# EAGLE design SparkFun_MicroMod_Function_Board_Blues_Notecarrier (EAGLE 9.6.2)
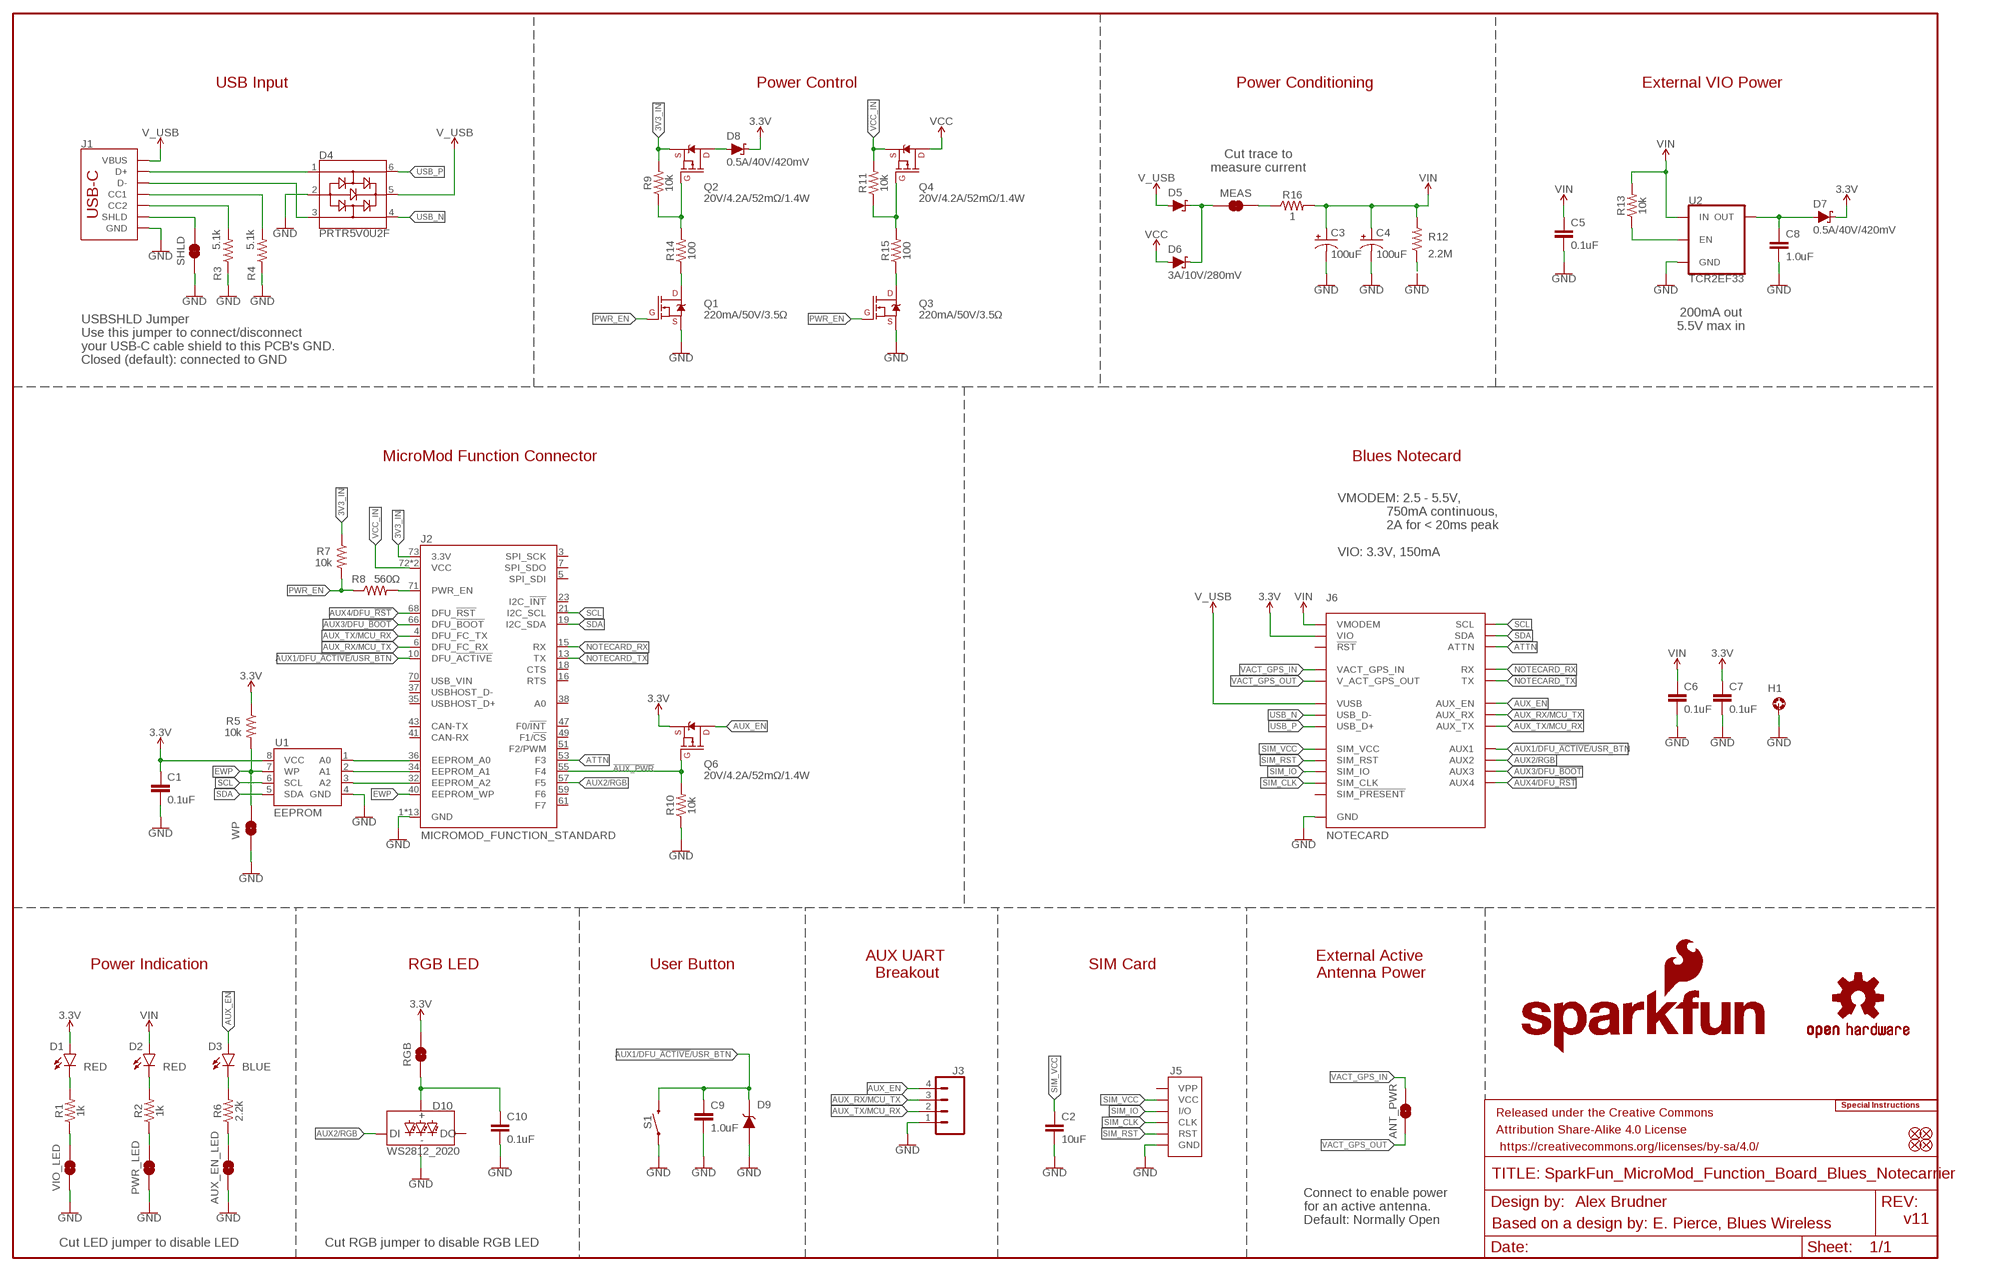
[diagram p0: schematic, sheet 1]

## Parts
ANT_PWR  JUMPER-SMT_2_NO_SILK  [SMT-JUMPER_2_NO_SILK]
AUX_EN_LED  JUMPER-SMT_2_NC_TRACE_SILK  [SMT-JUMPER_2_NC_TRACE_SILK]
C1  0.1uF  0.1UF-0402T-16V-10%  [0402-TIGHT]
C2  10uF  10UF-0805-10V-10%  [0805]
C3  100uF  100UF-POLAR-25V-20%-SMD(ELEC)  [PANASONIC_D]
C4  100uF  100UF-POLAR-25V-20%-SMD(ELEC)  [PANASONIC_D]
C5  0.1uF  0.1UF-0402T-16V-10%  [0402-TIGHT]
C6  0.1uF  0.1UF-0402T-16V-10%  [0402-TIGHT]
C7  0.1uF  0.1UF-0402T-16V-10%  [0402-TIGHT]
C8  1.0uF  1.0UF-0402T-16V-10%  [0402-TIGHT]
C9  1.0uF  1.0UF-0402T-16V-10%  [0402-TIGHT]
C10  0.1uF  0.1UF-0402T-16V-10%  [0402-TIGHT]
D1  RED  LED-RED0603  [LED-0603]
D2  RED  LED-RED0603  [LED-0603]
D3  BLUE  LED-BLUE0603  [LED-0603]
D4  PRTR5V0U2F  [SOT886]
D5  3A/10V/280mV  DIODE-SCHOTTKY-BAT60A  [SOD-323]
D6  3A/10V/280mV  DIODE-SCHOTTKY-BAT60A  [SOD-323]
D7  0.5A/40V/420mV  DIODE-SCHOTTKY-PMEG4005EJ  [SOD-323]
D8  0.5A/40V/420mV  DIODE-SCHOTTKY-PMEG4005EJ  [SOD-323]
D9  SMBJP6KE-DNP  [DO-214AA]
D10  WS2812_2020  [WS2812-2020]
FD1  FIDUCIALUFIDUCIAL  [FIDUCIAL-MICRO]
FD2  FIDUCIALUFIDUCIAL  [FIDUCIAL-MICRO]
FD3  FIDUCIALUFIDUCIAL  [FIDUCIAL-MICRO]
FD4  FIDUCIALUFIDUCIAL  [FIDUCIAL-MICRO]
FRAME1  FRAME-LEDGER  [CREATIVE_COMMONS]
H1  STAND-OFF-REFLOW-M2.5_2.5MM_TALL  [STAND-OFF-REFLOW-M2.5]
J1  USB_C_2-LAYER_PADS  [USB-C-16P-2LAYER-PADS]
J2  MICROMOD_FUNCTION_STANDARD  [M.2-CARD-E-22_FUNCTION_STANDARD]
J3  CONN_041X04_NO_SILK_NO_POP  [1X04_NO_SILK]
J5  SIMHOLDER-NANOSIM-MOLEX  [NANO_SIM_MOLEX_104224-0820]
J6  NOTECARD  [M.2-CONNECTOR-E]
LOGO1  SFE_LOGO_NAME_FLAME.1_INCH  [SFE_LOGO_NAME_FLAME_.1]
LOGO2  SPECIAL_INSTRUCTIONS-ORDERING  [ORDERING_INSTRUCTIONS]
LOGO3  OSHW-LOGOMINI  [OSHW-LOGO-MINI]
MEAS  JUMPER-COMBO_2_NC_TRACE  [COMBO-JUMPER_2_NC_TRACE]
PWR_LED  JUMPER-SMT_2_NC_TRACE_SILK  [SMT-JUMPER_2_NC_TRACE_SILK]
Q1  220mA/50V/3.5Ω  MOSFET-NCH-BSS138  [SOT23-3]
Q2  20V/4.2A/52mΩ/1.4W  MOSFET_PCH-DMG2305UX-7  [SOT23-3]
Q3  220mA/50V/3.5Ω  MOSFET-NCH-BSS138  [SOT23-3]
Q4  20V/4.2A/52mΩ/1.4W  MOSFET_PCH-DMG2305UX-7  [SOT23-3]
Q6  20V/4.2A/52mΩ/1.4W  MOSFET_PCH-DMG2305UX-7  [SOT23-3]
R1  1k  1KOHM-0402T-1/16W-1%  [0402-TIGHT]
R2  1k  1KOHM-0402T-1/16W-1%  [0402-TIGHT]
R3  5.1k  5.1KOHM-0402T-1/16W-1%  [0402-TIGHT]
R4  5.1k  5.1KOHM-0402T-1/16W-1%  [0402-TIGHT]
R5  10k  10KOHM-0402T-1/16W-1%  [0402-TIGHT]
R6  2.2k  2.2KOHM-0402T-1/16W-1%  [0402-TIGHT]
R7  10k  10KOHM-0402T-1/16W-1%  [0402-TIGHT]
R8  560Ω  560OHM_0402_TIGHT  [0402-TIGHT]
R9  10k  10KOHM-0402T-1/16W-1%  [0402-TIGHT]
R10  10k  10KOHM-0402T-1/16W-1%  [0402-TIGHT]
R11  10k  10KOHM-0402T-1/16W-1%  [0402-TIGHT]
R12  2.2M  2.2MOHMS-0402T-1/10W-1%  [0402-TIGHT]
R13  10k  10KOHM-0402T-1/16W-1%  [0402-TIGHT]
R14  100  100OHM-0402-TIGHT-1/16W-1%  [0402-TIGHT]
R15  100  100OHM-0402-TIGHT-1/16W-1%  [0402-TIGHT]
R16  1  1OHM-0603-1/10W-1%  [0603]
RGB  JUMPER-SMT_2_NC_TRACE_SILK  [SMT-JUMPER_2_NC_TRACE_SILK]
S1  MOMENTARY-SWITCH-SPST-SMD-4.6X2.8MM  [TACTILE_SWITCH_SMD_4.6X2.8MM]
SHLD  JUMPER-SMT_2_NC_TRACE_SILK  [SMT-JUMPER_2_NC_TRACE_SILK]
U1  EEPROM  EEPROM-I2C512K  [SO08]
U2  TCR2EF33  [SOT23-5]
VIO_LED  JUMPER-SMT_2_NC_TRACE_SILK  [SMT-JUMPER_2_NC_TRACE_SILK]
WP  JUMPER-SMT_2_NO_SILK  [SMT-JUMPER_2_NO_SILK]

## Nets
3.3V [Power]: C1.1 C7.1 D1.A D7.C D8.C J6.2(VIO) J6.4(VIO) Q6.2(S) R5.1 RGB.2 U1.8(VCC)
3V3_IN [Power]: J2.73(3.3V) Q2.2(S) R7.1 R9.2
!AUX_PWR!: J2.55(F4) Q6.1(G) R10.2
A0: J2.36(EEPROM_A0) U1.1(A0)
A1: J2.34(EEPROM_A1) U1.2(A1)
A2: J2.32(EEPROM_A2) U1.3(A2)
ATTN: J2.53(F3) J6.54(ATTN)
AUX1/DFU_!ACTIVE!/USR_BTN: C9.1 D9.C J2.10(DFU_!ACTIVE!) J6.46(AUX1) S1.3 S1.4
AUX2/RGB: D10.DI J2.57(F5) J6.48(AUX2)
AUX3/DFU_!BOOT!: J2.66(DFU_!BOOT!) J6.50(AUX3)
AUX4/DFU_!RST!: J2.68(DFU_!RST!) J6.52(AUX4)
AUX_EN: D3.A J3.4 J6.56(AUX_EN) Q6.3(D)
AUX_RX/MCU_TX: J2.6(DFU_FC_RX) J3.3 J6.58(AUX_RX)
AUX_TX/MCU_RX: J2.4(DFU_FC_TX) J3.2 J6.60(AUX_TX)
EWP: J2.40(EEPROM_WP) R5.2 U1.7(WP) WP.2
GND [GND]: AUX_EN_LED.1 C1.2 C2.2 C3.- C4.- C5.2 C6.2 C7.2 C8.2 C9.2 C10.2 D4.2 D9.A D10.GND H1.1 J1.GND J1.GND2(GND) J2.1(GND) J2.2(GND) J2.8(GND) J2.33(GND) J2.39(GND) J2.45(GND) J2.75(GND) J2.GND1(GND) J2.GND2(GND) J2.GND3(GND) J2.GND4(GND) J2.GND5(GND) J2.GND6(GND) J3.1 J5.G1(GND) J5.G2(GND) J5.G3(GND) J5.G4(GND) J5.S4(GND) J6.3(GND) J6.5(GND) J6.6(GND) J6.11(GND) J6.18(GND) J6.33(GND) J6.39(GND) J6.45(GND) J6.51(GND) J6.57(GND) J6.71(GND) J6.73(GND) PWR_LED.1 Q1.2(S) Q3.2(S) R3.1 R4.1 R10.1 R12.1 S1.1 S1.2 SHLD.1 U1.4(GND) U2.2(GND) VIO_LED.1 WP.1
N$1: J2.71(PWR_EN) R8.2
N$2: Q2.1(G) R9.1 R14.2
N$3: Q4.1(G) R11.1 R15.2
N$4: D1.C R1.2
N$5: R13.1 U2.3(EN)
N$6: D2.C R2.2
N$7 [Power]: D8.A Q2.3(D)
N$8: J1.B5(CC2) R3.2
N$9: J1.A5(CC1) R4.2
N$10 [Power]: C8.1 D7.A U2.5(OUT)
N$11: PWR_LED.2 R2.1
N$12: R1.1 VIO_LED.2
N$13: D3.C R6.2
N$14: AUX_EN_LED.2 R6.1
N$15: Q1.3(D) R14.1
N$16: Q3.3(D) R15.1
N$17: MEAS.2 MEAS.4 R16.1
N$18: C10.1 D10.VCC RGB.1
N$37 [Power]: D5.C D6.C MEAS.1 MEAS.3
NOTECARD_RX: J2.15(RX) J6.62(RX)
NOTECARD_TX: J2.13(TX) J6.64(TX)
PWR_EN: Q1.1(G) Q3.1(G) R7.2 R8.1
SCL: J2.21(I2C_SCL) J6.40(SCL) U1.6(SCL)
SDA: J2.19(I2C_SDA) J6.42(SDA) U1.5(SDA)
SHLD: J1.SHLD1(SHLD) J1.SHLD2(SHLD) J1.SHLD3(SHLD) J1.SHLD4(SHLD) SHLD.2
SIM_CLK: J5.S3(CLK) J6.14(SIM_CLK)
SIM_IO: J5.S6(I/O) J6.12(SIM_IO)
SIM_RST: J5.S2(RST) J6.10(SIM_RST)
SIM_VCC [Power]: C2.1 J5.S1(VCC) J6.8(SIM_VCC)
USB_IN_N [USB_DIFF]: D4.3 J1.A7(D-) J1.B7(D-)
USB_IN_P [USB_DIFF]: D4.1 J1.A6(D+) J1.B6(D+)
USB_N [USB_DIFF]: D4.4 J6.9(USB_D-)
USB_P [USB_DIFF]: D4.6 J6.7(USB_D+)
V_USB [Power]: D4.5 D5.A J1.VBUS1(VBUS) J1.VBUS2(VBUS) J6.13(VUSB)
VACT_GPS_IN [Power]: ANT_PWR.2 J6.22(VACT_GPS_IN)
VACT_GPS_OUT [Power]: ANT_PWR.1 J6.20(V_ACT_GPS_OUT)
VCC [Power]: D6.A Q4.3(D)
VCC_IN [Power]: J2.72(VCC) J2.74(VCC) Q4.2(S) R11.2
VIN [Power]: C3.+ C4.+ C5.1 C6.1 D2.A J6.70(VMODEM) J6.72(VMODEM) J6.74(VMODEM) R12.2 R13.2 R16.2 U2.1(IN)
Unconnected: D10.DO J2.3(SPI_SCK) J2.5(SPI_SDI) J2.7(SPI_SDO) J2.16(RTS) J2.18(CTS) J2.23(I2C_!INT!) J2.35(USBHOST_D+) J2.37(USBHOST_D-) J2.38(A0) J2.41(CAN-RX) J2.43(CAN-TX) J2.47(F0/!INT!) J2.49(F1/!CS!) J2.51(F2/PWM) J2.59(F6) J2.61(F7) J2.70(USB_VIN) J5.S5(VPP) J6.16(SIM_!PRESENT!) J6.67(!RST!)

## Notes on the sheet
- USB Input | Power Control | Power Conditioning | External VIO Power
- Cut trace to
  measure current
- 200mA out
  5.5V max in
- USBSHLD Jumper
  Use this jumper to connect/disconnect
  your USB-C cable shield to this PCB's GND.
  Closed (default): connected to GND
- MicroMod Function Connector | Blues Notecard
- VMODEM: 2.5 - 5.5V,
                750mA continuous, 
                2A for < 20ms peak
  
  VIO: 3.3V, 150mA
- Power Indication | RGB LED | User Button
- AUX UART 
  Breakout
- SIM Card
- External Active 
  Antenna Power
- Alex Brudner
- Connect to enable power 
  for an active antenna.
  Default: Normally Open
- v11
- Based on a design by: E. Pierce, Blues Wireless
- Cut LED jumper to disable LED | Cut RGB jumper to disable RGB LED

## Library data of the parts
ANT_PWR WP = SparkFun-Jumpers:JUMPER-SMT_2_NO: Normally open jumper This jumper has two pads in close proximity to each other. Apply solder to close the connection. Round pads are easier to solder for beginners, but are a lot larger. SparkFun Product that uses the round pads: SparkFun EL Sequencer <https://www.sparkfun.com/products/12781>
AUX_EN_LED PWR_LED RGB SHLD VIO_LED = SparkFun-Jumpers:JUMPER-SMT_2_NC_TRACE: Normally closed trace jumper This jumper has a trace between two pads so it's normally closed (NC). Use a razor knife to open the connection. For best results follow the IPC guidelines for cutting traces: Cutout at least 0.063 mm (0.005 in). Remove all loose material to clean up the cut area. Seal the cut with an approved epoxy. Reapply solder to reclose the connection.
C1 C5-C7 C10 = SparkFun-Capacitors:0.1UF: 0.1µF ceramic capacitors A capacitor is a passive two-terminal electrical component used to store electrical energy temporarily in an electric field.; PROD_ID: CAP-12416
C2 = SparkFun-Capacitors:10UF: 10.0µF ceramic capacitors A capacitor is a passive two-terminal electrical component used to store electrical energy temporarily in an electric field.; PROD_ID: CAP-11330
C3 C4 = SparkFun-Capacitors:100UF-POLAR: 100µF polarized capacitors A capacitor is a passive two-terminal electrical component used to store electrical energy temporarily in an electric field.; PN: EDH107M025A9HAA; PROD_ID: CAP-17222
C8 C9 = SparkFun-Capacitors:1.0UF: 1µF ceramic capacitors A capacitor is a passive two-terminal electrical component used to store electrical energy temporarily in an electric field.; PROD_ID: CAP-12417
D1 D2 = SparkFun-LED:LED-RED: Red SMD LED Used in manufacturing of most products at SparkFun Packages: 0603 - SMD 0603 package [Product Link] <http://docs.avagotech.com/docs/AV02-0551EN> 0603 SMART - SMD 0603 SMART package ( more efficient and expensive)[Product Link] <http://www.osram-os.com/Graphics/XPic2/00077099_0.pdf> 1206 - SMD1206 package [Product Link] <https://www.sparkfun.com/datasheets/DevTools/LilyPad/Q150OVS4.pdff> SparkFun Products: Pro Mini 328 -5V <https://www.sparkfun.com/products/821> RedBoard <https://www.sparkfun.com/products/12757> IOIO-OTG <https://www.sparkfun.com/products/13613>; PROD_ID: DIO-00819
D3 = SparkFun-LED:LED-BLUE: Blue SMD LED Used in manufacturing of various products at SparkFun Packages: 0603 - SMD 0603 package [Product Link] <http://www.digikey.com/product-detail/en/SMLE12BC7TT86/511-1589-2-ND/1641808> 1206 - SMD1206 package [Product Link] <http://www.digikey.com/product-detail/en/lite-on-inc/LTST-C150TBKT/160-1643-1-ND/573584> SparkFun Products: ESP8266 Thing-Dev Board <https://www.sparkfun.com/products/13711> RedBoard <https://www.sparkfun.com/products/12757>; PROD_ID: DIO-08575
D4 = SparkFun-IC-Power:PRTR5V0U2: A small ESD protection device. Most commonly used on USB D+/D- signals to protect large, expensive, or especially sensitive USB enabled devices.; PROD_ID: DIO-14084
D5 D6 = SparkFun-DiscreteSemi:DIODE-SCHOTTKY: Schottky diode A Schottky diode is a semiconductor diode which has a low forward voltage drop and a very fast switching action.; PROD_ID: DIO-14072
D7 D8 = SparkFun-DiscreteSemi:DIODE-SCHOTTKY: Schottky diode A Schottky diode is a semiconductor diode which has a low forward voltage drop and a very fast switching action.; PROD_ID: DIO-10955
D9 = SparkFun_MicroMod_Function_Board_Blues_Notecarrier:SMBJP6KE
D10 = SparkFun-LED:WS2812: Addressable RGB LED - 1 Wire Common names: WS2812, SK6812, Neopixel, APA-106, etc. SMD LED with built-in controller IC. Color: Red/Green/Blue SparkFun Products: LED-SMD RGB (WS2812) <https://www.sparkfun.com/products/11821> LED - RGB Addressable, PTH, 5mm Diffused (5 Pack) <https://www.sparkfun.com/products/12986> LED - RGB Addressable, PTH, 5mm Clear (5 Pack) <https://www.sparkfun.com/products/12999> Blynk Board - ESP8266 <https://www.sparkfun.com/products/13794> Datasheet referenced for footprint: WS2812B-PTH <https://cdn.sparkfun.com/datasheets/Components/LED/COM-12877.pdf>; PROD_ID: DIO-15591
FD1-FD4 = SparkFun-Aesthetics:FIDUCIAL: Fiducial Alignment Points Point-of-reference for pick-and-place machines and other optical instruments.
FRAME1 = SparkFun-Aesthetics:FRAME-LEDGER: Schematic Frame - Ledger Standard 11x14 US Ledger frame
H1 = SparkFun-Hardware:STAND-OFF-REFLOW: Stand Off Reflow Compatible A metal standoff that can be placed and reflowed onto a PCB. The M2.5 x 2.5mm variant is used on MicroMod. The M2.5 x 1.5mm variant is used to hold mPCIe boards, including the Swarm M138. The M2.0 x 6.0mm variant is used to mount the Iridium 9603N modem.; PROD_ID: HW-14899
J1 = SparkFun-Connectors:USB_C: USB Type C 16Pin Connector Super Speed pins not available on the 16-pin purely SMD connector so this part is best for USB 2.0 implementations. D1 and D2 are tied together enabling D+/- no matter which way the cable is plugged into the connector. The two channel configuration pins (CC1/2) are exposed. These are normally connected to ground via 5.1k resistors but can be reconfigured for high current/high power applications. **4-LAYER BOARD WARNING!!** If designing 4-layer board, make sure to select the variant _4-LAYER-ISOLATED. The linked footprint (USB-C-16-4LAYER-ISOLATED) includes some very necessary cutout polygons in the inner layers (2 and 15). This prevents the PTH mounting shield legs on the USB connector from electrically connecting any other polygons on the inner layers (usually VCC and GND).; PROD_ID: CONN-14122
J2 = SparkFun-MicroMod:MICROMOD_FUNCTION: MicroMod Connector Description: A card edge connector and mating PCB connector to allow various MicroMod Processor Boards to be coupled with various carrier boards of different capabilities. Based on the M.2 standard.
J3 = SparkFun-Connectors:CONN_04: Multi connection point. Often used as Generic Header-pin footprint for 0.1 inch spaced/style header connections On any of the 0.1 inch spaced packages, you can populate with these: Break Away Headers - Straight <https://www.sparkfun.com/products/116> (PRT-00116) Break Away Male Headers - Right Angle <https://www.sparkfun.com/products/553> (PRT-00553) Female Headers <https://www.sparkfun.com/products/115> (PRT-00115) Break Away Headers - Machine Pin <https://www.sparkfun.com/products/117> (PRT-00117) Break Away Female Headers - Swiss Machine Pin <https://www.sparkfun.com/products/743> (PRT-00743) For SCREWTERMINALS and SPRING TERMINALS visit here: Screw Terimnals on SparkFun.com <https://www.sparkfun.com/search/results?term=Screw+Terminals> (5mm/3.5mm/2.54mm spacing) This device is also useful as a general connection point to wire up your design to another part of your project. Our various solder wires solder well into these plated through hole pads. Hook-Up Wire - Assortment (Stranded, 22 AWG) <https://www.sparkfun.com/products/11375> (PRT-11375) Hook-Up Wire - Assortment (Solid Core, 22 AWG) <https://www.sparkfun.com/products/11367> (PRT-11367) View the entire wire category on our website here <https://www.sparkfun.com/categories/141> Special notes: Molex polarized connector foot print use with SKU : PRT-08231 with associated crimp pins and housings. 1MM SMD Version SKU: PRT-10208
J5 = SparkFun-Connectors:SIMHOLDER: SIM Cellular Card Socket SMT 6 pin standard connection. SparkFun Products: SIM Socket <https://www.sparkfun.com/products/548> SparkFun Cellular Shield - MG2639 <https://www.sparkfun.com/products/13120> SparkFun SIM Card Socket Breakout <https://www.sparkfun.com/products/573>; PROD_ID: CONN-15682
J6 = SparkFun_MicroMod_Function_Board_Blues_Notecarrier:NOTECARD; PROD_ID: CONN-14877
LOGO1 = SparkFun-Aesthetics:SFE_LOGO_NAME_FLAME: SparkFun Font Logo w/ Flame This is the SparkFun full logo. The logo on the schematic will always be the same size; the package variant is the height of the flame part of the logo. Default layer for the logo on the board is tSilk.
LOGO2 = SparkFun-Aesthetics:SPECIAL_INSTRUCTIONS: Special Ordering/Production Instructions Alert Symbol for special PCB ordering instructions or unique production process warnings. Ordering Instructions Production Instructions Types of information that should be added to box: Copper weight Soldermask color Silk color PCB thickness Number of layers PCB Standard: 1.6mm FR4 1 oz copper immersion silver plating red soldermask white silkscreen Types of information that should be added to box: Special wash requirements Depaneling instructions Humidification Glue curing Default text settings: 0.07 inch 9% ratio 50% line distance
LOGO3 = SparkFun-Aesthetics:OSHW-LOGO: Open-Source Hardware (OSHW) Logo This logo indicates the piece of hardware it is found on incorporates a OSHW license and/or adheres to the definition of open source hardware found here: http://freedomdefined.org/OSHW
MEAS = SparkFun-Jumpers:JUMPER-COMBO_2_NC_TRACE
Q1 Q3 = SparkFun-DiscreteSemi:MOSFET-NCH: N-channel MOSFETs Voltage controlled devices that allow control of high current outputs. SparkFun Products: SparkFun OpenScale <https://www.sparkfun.com/products/13261> SparkFun Digital Sandbox <https://www.sparkfun.com/products/12651> SparkFun Monster Moto Shield <https://www.sparkfun.com/products/10182> SparkFun MOSFET Power Controller <https://www.sparkfun.com/products/11214>; PROD_ID: TRANS-00830
Q2 Q4 Q6 = SparkFun-DiscreteSemi:MOSFET_PCH: P-channel MOSFETs Voltage controlled devices that allow control of high current outputs. SparkFun Products: SparkFun ESP32 Thing <https://www.sparkfun.com/products/13907> SparkFun ESP8266 Thing <https://www.sparkfun.com/products/13231> SparkFun Pi Servo HAT V2 <https://www.sparkfun.com/products/15316> DMG2305UX-7 (20V/4.2A/SOT23-3); PROD_ID: TRANS-14388
R1 R2 = SparkFun-Resistors:1KOHM: 1kΩ resistor A resistor is a passive two-terminal electrical component that implements electrical resistance as a circuit element. Resistors act to reduce current flow, and, at the same time, act to lower voltage levels within circuits. - Wikipedia; PROD_ID: RES-14342
R3 R4 = SparkFun-Resistors:5.1KOHM; PROD_ID: RES-14340
R5 R7 R9-R11 R13 = SparkFun-Resistors:10KOHM: 10kΩ resistor A resistor is a passive two-terminal electrical component that implements electrical resistance as a circuit element. Resistors act to reduce current flow, and, at the same time, act to lower voltage levels within circuits. - Wikipedia; PROD_ID: RES-14241
R6 = SparkFun-Resistors:2.2KOHM: 2.2kΩ resistor A resistor is a passive two-terminal electrical component that implements electrical resistance as a circuit element. Resistors act to reduce current flow, and, at the same time, act to lower voltage levels within circuits. - Wikipedia; PROD_ID: RES-14341
R8 = SparkFun-Resistors:560OHM; PROD_ID: RES-13766
R12 = SparkFun-Resistors:2.2MOHMS: 2MΩ resistor A resistor is a passive two-terminal electrical component that implements electrical resistance as a circuit element. Resistors act to reduce current flow, and, at the same time, act to lower voltage levels within circuits. - Wikipedia; PROD_ID: RES-14844
R14 R15 = SparkFun-Resistors:100OHM: 100Ω resistor A resistor is a passive two-terminal electrical component that implements electrical resistance as a circuit element. Resistors act to reduce current flow, and, at the same time, act to lower voltage levels within circuits. - Wikipedia; PROD_ID: RES-14962
R16 = SparkFun-Resistors:1OHM: 1Ω resistor A resistor is a passive two-terminal electrical component that implements electrical resistance as a circuit element. Resistors act to reduce current flow, and, at the same time, act to lower voltage levels within circuits. - Wikipedia; PROD_ID: RES-08269
S1 = SparkFun-Switches:MOMENTARY-SWITCH-SPST: Momentary Switch (Pushbutton) - SPST Normally-open (NO) SPST momentary switches (buttons, pushbuttons). Variants PTH-12MM - 12mm square, through-hole Momentary Pushbutton Switch - 12mm Square <https://www.sparkfun.com/products/9190> (COM-09190) PTH-6.0MM, PTH-6.0MM-KIT - 6.0mm square, through-hole Mini Pushbutton Switch <https://www.sparkfun.com/products/97> (COM-00097) KIT package intended for soldering kit's - only one side of pads' copper is exposed. PTH-RIGHT-ANGLE-KIT - Right-angle, through-hole Right Angle Tactile Button <https://www.sparkfun.com/products/10791> - Used on SparkFun BigTime Watch Kit <https://www.sparkfun.com/products/11734> SMD-12MM - 12mm square, surface-mount Tactile Button - SMD (12mm) <https://www.sparkfun.com/products/12993> (COM-12993) Used on SparkFun PicoBoard <https://www.sparkfun.com/products/11888> SMD-4.5MM - 4.5mm Square Trackball Switch Used on SparkFun Blackberry Trackballer Breakout <https://www.sparkfun.com/products/13169> SMD-4.6MMX2.8MM - 4.60mm x 2.80mm, surface mount Used on SparkFun Pro Micro - RP2040 <https://www.sparkfun.com/products/17717> SMD-5.2MM, SMD-5.2-REDUNDANT - 5.2mm square, surface-mount Mini Pushbutton Switch - SMD <https://www.sparkfun.com/products/8720> (COM-08720) Used on Arduino Pro Mini <https://www.sparkfun.com/products/11114> REDUNDANT package connects both switch circuits together SMD-6.0X3.5MM - 6.0 x 3.5mm, surface mount Momentary Reset Switch SMD <https://www.sparkfun.com/products/8229> (COM-08229) SMD-6.2MM-TALL - 6.2mm square, surface mount Tactile Button - SMD (6mm) <https://www.sparkfun.com/products/12992> Used on SparkFun Digital Sandbox <https://www.sparkfun.com/products/12651> SMD-RIGHT-ANGLE - Right-angle, surface mount Used on SparkFun Block for Intel® Edison - Arduino <https://www.sparkfun.com/products/13036>; PROD_ID: SWCH-15606
U1 = SparkFun-IC-Memory:EEPROM-I2C: I2C EEPROMs, 24LC256 and others 24LC256 Series 256 kb I2C 2 Wire (32 k x 8 Bit) 2.5 V Serial EEPROM SMD - SOIC-8 Datasheet SparkFun Products SparkFun UDB5 - PIC UAV Development Board <https://www.sparkfun.com/products/11703> (GPS-11703); PROD_ID: IC-14645
U2 = SparkFun_MicroMod_Function_Board_Blues_Notecarrier:TCR2EF33; PROD_ID: VREG-16875

## Net classes
1 USB_DIFF: width 0.25 mm, clearance 0.2 mm
4 GND: clearance 0.15 mm to class 0

## Board
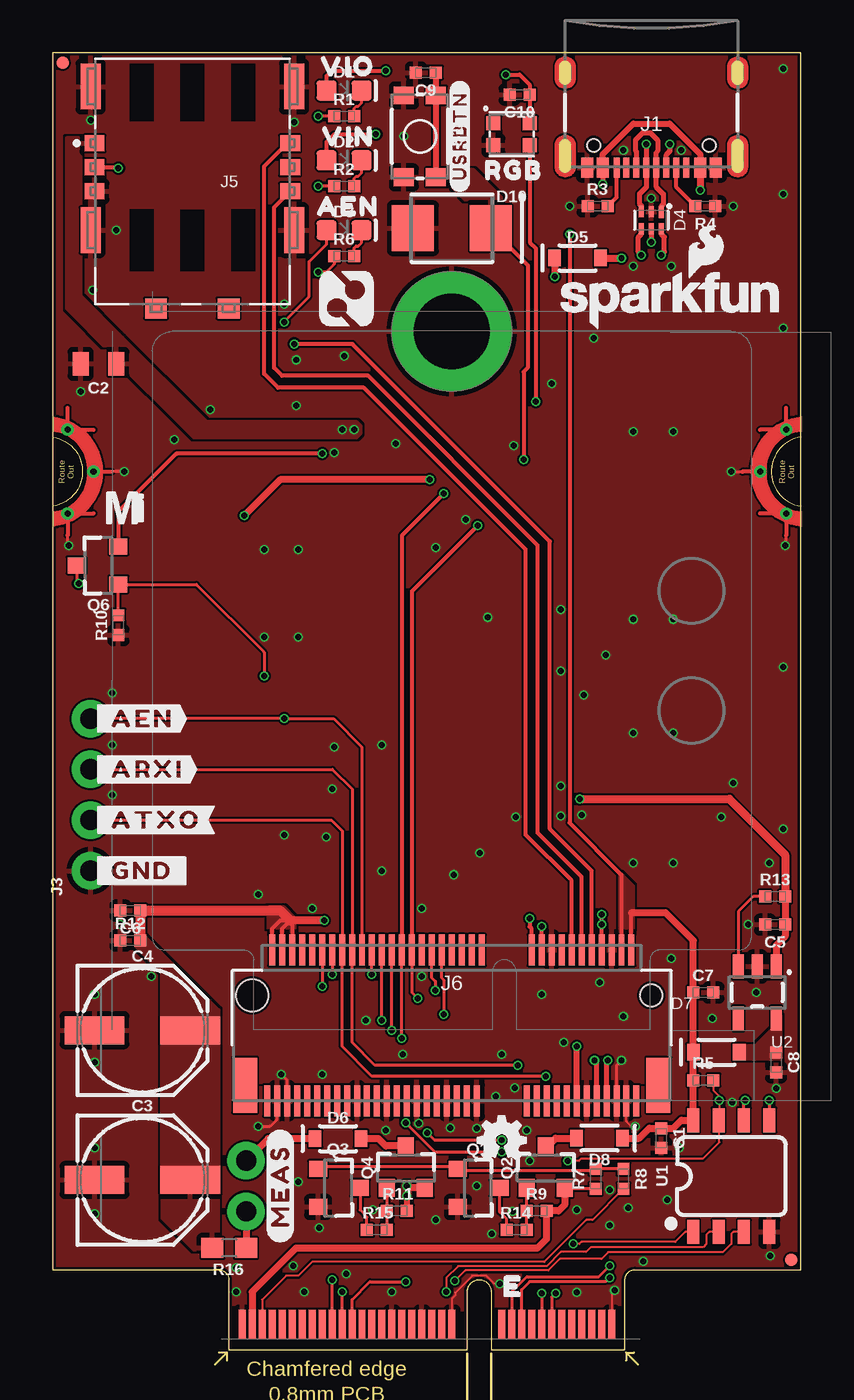
[diagram p1: board, top side]
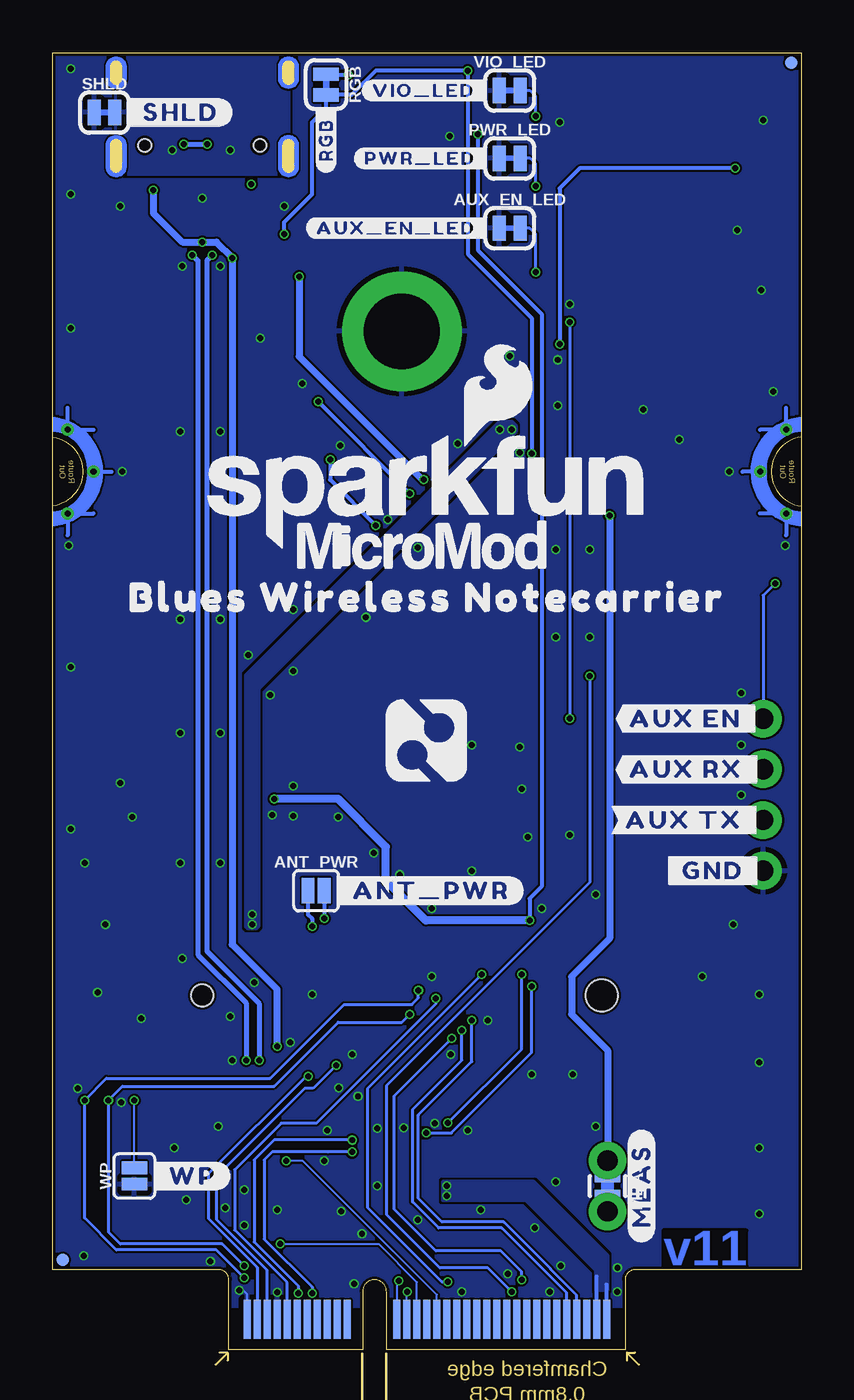
[diagram p2: board, bottom side, seen from below]

Size 37.5 x 65 mm. Coordinates in mm from the lower left corner, seen from the top.
Outline: 37.49,4 37.49,65 0,65 0,4 8.32,4 arc-90 8.82,3.5 8.82,0 20.77,0 20.77,2.9 arc-90 21.37,3.5 21.38,3.5 arc-90 21.97,2.91 21.97,0 28.67,0 28.67,3.51 arc-90 29.17,4 37.49,4
Copper layers (1*16): Top 0.035mm / dielectric 0.8mm / Bottom 0.035mm
Design rules "SparkFun-4-Layer-MicroMod-JLCPCB *": minimum track width 4mil, minimum drill 0.2mm, track to track 4mil, track to pad 4mil, pad to pad 4mil, via to via 4mil, smd to smd 4mil, copper to edge 6mil, drill to drill 6mil, minimum pad ring 3mil, minimum via ring 3mil, stop-mask expansion 2.5mil, vias tented up to drill 25mil, thermal gap 10mil
tRestrict: area 11.4,12.2 to 11.6,12.7; area 28.4,12.3 to 28.6,12.7

### Footprints (pad centres in the part's own frame; a part is rotated, then mirrored left to right if it is on the bottom)
SMT-JUMPER_2_NO_SILK = smd 0.635 x 1.27: 1 -0.406,0; 2 0.406,0
SMT-JUMPER_2_NC_TRACE_SILK = smd 0.66 x 1.27: 1 -0.521,0; 2 0.521,0
0402-TIGHT = smd 0.6 x 0.6: 1 -0.5,0; 2 0.5,0
0805 = smd 0.8 x 1.2: 1 -0.9,0; 2 0.9,0
PANASONIC_D = smd 3 x 1.4: + 2.4,0; - -2.4,0
LED-0603 = smd 1 x 1: A -0.877,0; C 0.877,0
SOT886 = smd 0.61 x 0.25: 1 -0.405,0.5 | smd 0.56 x 0.25: 2 -0.43,0; 3 -0.43,-0.5; 4 0.43,-0.5; 5 0.43,0; 6 0.43,0.5
SOD-323 = smd 0.63 x 0.83: A 1.15,0; C -1.15,0
DO-214AA = smd 2.1 x 2.3: A -1.95,0; C 1.95,0
WS2812-2020 = smd 0.7 x 0.7: DI -0.915,0.55; DO 0.915,-0.55; GND 0.915,0.55; VCC -0.915,-0.55
FIDUCIAL-MICRO = smd 0.635 x 0.635: 1 0,0
STAND-OFF-REFLOW-M2.5 = drill 3.8 pad 6: 1 0,0
USB-C-16P-2LAYER-PADS = smd 0.3 x 1: A5 -1.25,-0.34; A6 -0.25,-0.34; A7 0.25,-0.34; A8 1.25,-0.34; B5 1.75,-0.34; B6 0.75,-0.34; B7 -0.75,-0.34; B8 -1.75,-0.34 | smd 0.6 x 1: GND -3.225,-0.34; GND2 3.225,-0.34; VBUS1 -2.45,-0.34; VBUS2 2.45,-0.34 | drill 0.4 pad 0.6 long: SHLD1 -4.318,-0.915; SHLD2 4.318,-0.915; SHLD3 -4.318,-5.095; SHLD4 4.318,-5.095 | hole 0.65: -2.89,-1.445; 2.89,-1.445
M.2-CARD-E-22_FUNCTION_STANDARD = smd 0.35 x 1.45: 1 9.25,1.275; 3 8.75,1.275; 5 8.25,1.275; 7 7.75,1.275; 9 7.25,1.275; 11 6.75,1.275; 13 6.25,1.275; 15 5.75,1.275; 17 5.25,1.275; 19 4.75,1.275; 21 4.25,1.275; 23 3.75,1.275; 33 1.25,1.275; 35 0.75,1.275; 37 0.25,1.275; 39 -0.25,1.275; 41 -0.75,1.275; 43 -1.25,1.275; 45 -1.75,1.275; 47 -2.25,1.275; 49 -2.75,1.275; 51 -3.25,1.275; 53 -3.75,1.275; 55 -4.25,1.275; 57 -4.75,1.275; 59 -5.25,1.275; 61 -5.75,1.275; 63 -6.25,1.275; 65 -6.75,1.275; 67 -7.25,1.275; 69 -7.75,1.275; 71 -8.25,1.275; 73 -8.75,1.275; 75 -9.25,1.275 | smd 0.35 x 1.95 bottom: 2 9,1.525; 4 8.5,1.525; 6 8,1.525; 8 7.5,1.525; 10 7,1.525; 12 6.5,1.525; 14 6,1.525; 16 5.5,1.525; 18 5,1.525; 20 4.5,1.525; 22 4,1.525; 32 1.5,1.525; 34 1,1.525; 36 0.5,1.525; 38 0,1.525; 40 -0.5,1.525; 42 -1,1.525; 44 -1.5,1.525; 46 -2,1.525; 48 -2.5,1.525; 50 -3,1.525; 52 -3.5,1.525; 54 -4,1.525; 56 -4.5,1.525; 58 -5,1.525; 60 -5.5,1.525; 62 -6,1.525; 64 -6.5,1.525; 66 -7,1.525; 68 -7.5,1.525; 70 -8,1.525; 72 -8.5,1.525; 74 -9,1.525 | drill 0.305 pad 0.61: GND1 -18,41.9; GND2 -16.7,44; GND3 -18,46.1; GND4 18,41.9; GND5 16.7,44; GND6 18,46.1
1X04_NO_SILK = drill 1.016 pad 1.88: 1 0,0; 2 2.54,0; 3 5.08,0; 4 7.62,0
NANO_SIM_MOLEX_104224-0820 = smd 1 x 2.3: G1 -5.1,1.5; G2 -5.1,8.7; G3 5.1,8.7; G4 5.1,1.5 | smd 1.1 x 1: R1 -1.82,12.625; R2 1.82,12.625 | smd 1 x 0.8: S1 4.9,4.35; S2 4.9,5.55; S3 -4.9,4.35; S4 4.9,6.75; S5 -4.9,5.55; S6 -4.9,6.75
M.2-CONNECTOR-E = smd 0.3 x 1.55: 1 9.25,-5.275; 2 9,2.275; 3 8.75,-5.275; 4 8.5,2.275; 5 8.25,-5.275; 6 8,2.275; 7 7.75,-5.275; 8 7.5,2.275; 9 7.25,-5.275; 10 7,2.275; 11 6.75,-5.275; 12 6.5,2.275; 13 6.25,-5.275; 14 6,2.275; 15 5.75,-5.275; 16 5.5,2.275; 17 5.25,-5.275; 18 5,2.275; 19 4.75,-5.275; 20 4.5,2.275; 21 4.25,-5.275; 22 4,2.275; 23 3.75,-5.275; 32 1.5,2.275; 33 1.25,-5.275; 34 1,2.275; 35 0.75,-5.275; 36 0.5,2.275; 37 0.25,-5.275; 38 0,2.275; 39 -0.25,-5.275; 40 -0.5,2.275; 41 -0.75,-5.275; 42 -1,2.275; 43 -1.25,-5.275; 44 -1.5,2.275; 45 -1.75,-5.275; 46 -2,2.275; 47 -2.25,-5.275; 48 -2.5,2.275; 49 -2.75,-5.275; 50 -3,2.275; 51 -3.25,-5.275; 52 -3.5,2.275; 53 -3.75,-5.275; 54 -4,2.275; 55 -4.25,-5.275; 56 -4.5,2.275; 57 -4.75,-5.275; 58 -5,2.275; 59 -5.25,-5.275; 60 -5.5,2.275; 61 -5.75,-5.275; 62 -6,2.275; 63 -6.25,-5.275; 64 -6.5,2.275; 65 -6.75,-5.275; 66 -7,2.275; 67 -7.25,-5.275; 68 -7.5,2.275; 69 -7.75,-5.275; 70 -8,2.275; 71 -8.25,-5.275; 72 -8.5,2.275; 73 -8.75,-5.275; 74 -9,2.275; 75 -9.25,-5.275 | smd 1.2 x 2.75: A1 10.35,-4.5; A2 -10.35,-4.5 | hole 1.1: 10,0 | hole 1.6: -10,0
COMBO-JUMPER_2_NC_TRACE = smd 0.635 x 1.27: 1 -0.508,0; 2 0.508,0 | drill 1.016 pad 1.88: 3 -1.27,0; 4 1.27,0
SOT23-3 = smd 0.8 x 0.9: 1 -0.95,-1; 2 0.95,-1; 3 0,1.1
0603 = smd 1.1 x 1: 1 -0.85,0; 2 0.85,0
TACTILE_SWITCH_SMD_4.6X2.8MM = smd 0.9 x 1: 1 -2.05,-0.8; 2 2.05,-0.8; 3 2.05,0.8; 4 -2.05,0.8
SO08 = smd 0.6 x 1.2: 1 -1.905,-2.8; 2 -0.635,-2.8; 3 0.635,-2.8; 4 1.905,-2.8; 5 1.905,2.8; 6 0.635,2.8; 7 -0.635,2.8; 8 -1.905,2.8
SOT23-5 = smd 0.55 x 1.2: 1 -0.95,-1.3; 2 0,-1.3; 3 0.95,-1.3; 4 0.95,1.3; 5 -0.95,1.3

### Placement (x,y rotation side)
ANT_PWR  24.3,23 0 bottom
AUX_EN_LED  14.6,56.2 0 bottom
C1  30.5,10.6 270 top
C2  2.3,49.4 180 top
C3  4.5,8.5 0 top
C4  4.5,16 0 top
C5  36.2,21.3 180 top
C6  3.9,22 180 top
C7  32.6,17.9 0 top
C8  36.25,14.4 270 top
C9  18.7,64 180 top
C10  23.4,62.9 180 top
D1  14.6,63.1 0 top
D2  14.6,59.6 0 top
D3  14.6,56.1 0 top
D4  30,56.6 270 top
D5  26.3,54.7 0 top
D6  14.3,10.57 0 top
D7  33.25,14.9 0 top
D8  27.4,10.6 180 top
D9  20,56.2 0 top
D10  23,60.9 180 top
FD1  0.5,64.5 0 top
FD2  0.5,64.5 0 bottom
FD3  37,4.5 0 bottom
FD4  37,4.5 0 top
FRAME1  21.59,-8.89 0 top  (outside the outline)
H1  20,51.03 0 top
J1  30,58.9 180 top
J2  18.75,0 0 top
J3  1.9,24 90 top
J5  7,64.8 180 top
J6  20,17.75 0 top
LOGO1  31,52.6 0 top
LOGO2  41.7,59.6 0 top  (outside the outline)
LOGO3  22.5,10.5 0 top
MEAS  9.7,8.2 270 bottom
PWR_LED  14.6,59.7 0 bottom
Q1  21.3,8.1 270 top
Q2  24.7,9.1 0 top
Q3  14.3,8.1 270 top
Q4  17.7,9.1 0 top
Q6  2.3,39.3 90 top
R1  14.6,61.8 0 top
R2  14.6,58.3 0 top
R3  27.3,57.3 0 top
R4  32.7,57.3 180 top
R5  32.6,13.5 0 top
R6  14.6,54.8 0 top
R7  27.2,8.55 90 top
R8  28.6,8.55 270 top
R9  24.25,6.95 0 top
R10  3.3,36.3 90 top
R11  17.25,6.95 0 top
R12  3.9,20.5 0 top
R13  36.2,22.7 0 top
R14  23.25,6 0 top
R15  16.25,6 0 top
R16  8.85,5.1 180 top
RGB  23.8,63.4 270 bottom
S1  18.4,60.8 270 top
SHLD  34.9,62 0 bottom
U1  34,8.7 0 top
U2  35.3,17.9 180 top
U$1  [AEN1]  14.8,57.3 0 top
U$2  [VIN3]  14.8,60.8 0 top
U$3  [VIO4]  14.8,64.3 0 top
U$4  [#VIO_LED_#21]  22,63.1 0 bottom
U$5  [#_ARXI#0]  1.9,29.08 0 top
U$6  [SFE_LOGO_FLAME_STOP_.1]  3.6,46.5 0 top
U$7  [#_GND_#0]  1.9,24 0 top
U$8  [#_WP#2]  32.7,8.7 0 bottom
U$9  [BLUES_WIRELESS_NOTECARRIER0]  18.75,37.7 0 bottom
U$10  [NOTEHUB_BLUES#SVG7]  20.75,32.5 0 bottom
U$11  [#_ATXO#0]  1.9,26.54 0 top
U$12  [#AUX_TX_#0]  9.5,26.54 0 bottom
U$13  [#_AEN#0]  1.9,31.62 0 top
U$14  [SFE_LOGO_NAME_FLAME_.2]  18.75,43 0 bottom
U$15  [#AUX_RX_#0]  9.3,29.08 0 bottom
U$16  [#MEAS#4]  8,8.2 90 bottom
U$17  [#MEAS#4]  11.4,8.2 90 top
U$18  [#_ANT_PWR#5]  18.7,23 0 bottom
U$19  [#AUX_EN_LED_#20]  24.8,56.2 0 bottom
U$20  [#_SHLD#23]  34,62 0 bottom
U$21  [#PWR_LED_#17]  22.4,59.7 0 bottom
U$22  [#_GND_#24]  7,24 0 bottom
U$23  [NOTEHUB_BLUES#SVG5]  13.4,54 0 top
U$24  [#RGB_#0]  23.8,59 90 bottom
U$25  [#USRBTN#0]  20.4,60.8 90 top
U$26  [RGB0]  23.1,59.1 0 top
U$29  [MICROMOD_MI_LOGO_.35]  3.6,42.2 0 top
U$30  [#AUX_EN_#0]  9.3,31.62 0 bottom
U$31  [MICROMOD_LOGO_.5]  19,40.3 0 bottom
VIO_LED  14.6,63.1 0 bottom
WP  33.4,8.7 90 bottom

### Tracks (layer width: path | path; a pad name or v marks a point on that pad's centre or on a via)
3.3V  (via drill 0.3)
  Top 0.2: J6.4 28.5,23.8 25.9,26.4 v25.9,55.9 | J6.2 29,21.9 | D1.A 13.72,63.82 14,64.1 v16.7,64.1 | Q6.2 3.3,42 6.2,44.9 v13.5,44.9
  Top 0.35: 29,21.9 30.7,21.9 32.1,20.5 C7.1 D7.C R5.1 U1.8 31.5,11.5 31.1,11.1 C1.1 29.9,11.1 29.4,10.6 D8.C
  Bottom 0.2: v25.9,55.9 25.9,56.49 24.5,57.9 24.5,61.5 23.8,62.2 RGB.2 22.52,62.88 21.3,64.1 v16.7,64.1 16.7,54.9 13.5,51.7 v13.5,44.9
  pour Top: 28.4,21 29.1,21 29.1,23.2 28.4,23.9
3V3_IN
  Top 0.15: R7.1 25.7,8.05 Q2.2
  Top 0.35: Q2.2 25.65,7.25 25.35,6.95 R9.2 24.75,5.55 24.3,5.1 12.2,5.1 10,2.9 J2.73
!AUX_PWR!  (via drill 0.3)
  Top 0.15: J2.55 v14.5,2.9 | Q6.1 3.4,38.25 | R10.2 Q6.1 | Q6.1 7.2,38.35 10.6,34.95 v10.6,33.75
  Bottom 0.15: v14.5,2.9 15.7,4.1 18.1,4.1 20.78,6.78 20.78,13.22 10.6,23.4 v10.6,33.75
A0  (via drill 0.3)
  Top 0.11: U1.1 31.7,5.9 31.2,5.4 26.49,5.4 26.39,5.3 v26.09,5.3
  Bottom 0.11: v26.09,5.3 21.17,5.3 19.25,3.38 J2.36
A1  (via drill 0.3)
  Top 0.11: v19.73,2.9 19.73,3.6 20.32,4.18 24.75,4.18 25.46,4.9 26.73,4.9 26.97,5.14 32.59,5.14 32.75,5.3 32.75,5.75 32.9,5.9 U1.2
  Bottom 0.11: v19.73,2.9 19.75,2.88 J2.34
A2  (via drill 0.3)
  Top 0.11: v20.15,3.44 20.68,3.97 24.84,3.97 25.42,4.55 27.5,4.55 27.83,4.88 33.58,4.88 34,5.3 34,5.8 34.1,5.9 U1.3
  Bottom 0.11: v20.15,3.44 20.25,3.34 J2.32
  Bottom 0.15: J2.32
ATTN  (via drill 0.3)
  Top 0.15: J2.53 15,2.5 15.9,3.4 v17.7,3.4 | v16,18.8 J6.54
  Bottom 0.15: v17.7,3.4 18,3.4 21.7,7.1 21.7,13.1 v16,18.8
AUX1/DFU_!ACTIVE!/USR_BTN  (via drill 0.3)
  Top 0.15: J6.46 18,17.9 v18.3,17.6
  Top 0.2: D9.C 23.8,54.35 23.8,49.2 23.6,49 v23.6,44.6 | v21.3,41.3 18,38 J6.46
  Top 0.3: C9.1 S1.4 S1.3
  Bottom 0.15: J2.10 25.75,3.36 28.38,5.99 28.38,9.02 26.05,11.35 24.28,11.35 18.3,17.33 v18.3,17.6
  Bottom 0.2: v23.6,44.6 23.6,43.6 v21.3,41.3
  pour Top: 18.9,58.4 19.9,58.4 21,57.3 21,57 22.9,57 22.9,57.3 21.4,58.8 21.1,59.1 18.9,59.1
AUX2/RGB  (via drill 0.3)
  Top 0.15: J2.57 v14,3.5 | v17.5,15.6 J6.48
  Top 0.2: J6.48 17.5,40.8 v19.6,42.9 | D10.DI 23.91,55.48 24.2,55.2 v24.2,47.5
  Bottom 0.15: v14,3.5 14,3.9 15.05,4.95 18.3,4.95 20.38,7.03 20.38,12.72 v17.5,15.6
  Bottom 0.2: v24.2,47.5 v19.6,42.9
AUX3/DFU_!BOOT!  (via drill 0.3)
  Top 0.15: v17,16 J6.50
  Bottom 0.15: J2.66 11.75,2.85 15,6.1 18.16,6.1 19.46,7.4 19.46,12.04 17,14.5 v17,16
AUX4/DFU_!RST!  (via drill 0.3)
  Top 0.15: v16.5,16.5 J6.52
  Bottom 0.15: J2.68 11.25,2.73 12.55,4.03 12.55,4.05 14.9,6.4 18,6.4 19.18,7.58 19.18,11.76 16.5,14.44 v16.5,16.5
AUX_EN  (via drill 0.3)
  Top 0.15: J6.56 15.5,30.2 14.08,31.62 v11.6,31.62 J3.4 | Q6.3 1.2,38.5 v1.3,38.4 | D3.A 13.72,55.4 12.85,54.53 12.85,52.78 11.6,51.53
  Top 0.2: v11.6,51.5 11.6,51.53
  Bottom 0.15: v11.6,51.5 v11.6,31.62 | v1.3,38.4 1.9,37.8 J3.4
AUX_RX/MCU_TX  (via drill 0.3)
  Top 0.15: v23.3,14.25 16.15,14.25 15,15.4 J6.58 15,28.1 14.02,29.08 J3.3
  Bottom 0.15: v23.3,14.25 24.45,13.1 24.86,13.1 29.3,8.66 29.3,6.54 26.75,3.99 J2.6
AUX_TX/MCU_RX  (via drill 0.3)
  Top 0.15: v24.7,13.7 16,13.7 14.5,15.2 J6.60 14.5,26 13.96,26.54 J3.2
  Bottom 0.15: v24.7,13.7 24.8,13.7 29.7,8.8 29.7,6.57 27.25,4.12 J2.4
EWP  (via drill 0.3)
  Top 0.11: 33.4,11.54 v33.4,12.5 33.4,12.7 33.1,13 R5.2 | 33.4,11.46 33.4,10.4 32.57,9.57 26.47,9.57 26.36,9.46 v25.8,9.46
  Top 0.15: 33.4,11.46 U1.7
  Top 0.2: 33.4,11.54 U1.7
  Bottom 0.11: WP.2 v33.4,12.5 | J2.40 18.25,2.75 24.96,9.46 v25.8,9.46
GND  (via drill 0.3)
  Top 0.11: v29.2,11.2 29,11.2 28.75,11.45 J6.3 | v22.4,3.3 22.12,3.3 21.72,3.71 21.02,3.71 20.16,2.85 20.16,2.72 20,2.56 J2.33 | v28.15,2.97 28,2.82 J2.1
  Top 0.15: v10.3,11.2 10.9,11.2 11.25,11.55 J6.73 | v3.6,44 J2.GND2 | v36.7,40.3 36.75,40.35 J2.GND4 | v34,44 J2.GND5 | v0.8,40.3 0.75,40.35 J2.GND1 | J6.71 11.75,13.5 v11.45,13.8 | J6.5 28.25,14.24 28.3,14.29 28.3,14.3 v28.5,14.5
  Bottom 0.11: J2.2 27.75,2.77 27.95,2.97 v28.15,2.97
  other vias: 17,2.89 9.21,2.9 26.25,7 12.05,4.2 30,57.7 13.35,6.1 29.59,4.42 11.6,52.4 12.6,2.9 14.7,3.8 21.24,8.2 15.7,16.5 29.1,24.4 27.9,6.24 30.8,7.5 23.04,6.92 25.6,15.4 22.5,14.8 24.5,17.8 28.6,16.7 13.5,13.8 16.7,11 9.2,4.1 12.3,8.4 2.1,6.8 2.1,10.1 2.1,14.4 2.1,17.8 3.4,21.3 13,22.1 13.7,25.7 16.5,24 16.5,30.3 14,28.1 14.1,30.2 21.8,36.7 31.1,24.4 29.1,30.9 31.1,30.9 29.1,36.6 31.1,36.6 23.1,45.3 17.2,45.4 20.7,41.6 12.2,47.3 14.6,49.8 12.2,49.6 7.9,47.1 31.1,46 29.1,46 31,54.3 29.1,54.3 34.1,57.3 25.9,57.3 17.6,60.8 1.4,48 2,53.1 3.2,56.1 1.9,61.6 12.1,61.5 11.6,25.8 31,19.6 14.1,44.95 19.2,40.2 27.7,34.8 18.5,22.1 20.1,23.8 21.4,24.9 23.2,26.7 25.45,26.75 26.5,26.8 25.45,28.25 25.45,34 26.6,32.8 25.45,37.1 27.9,8 19.92,11.11 21.24,11.1 17.55,14.8 23.16,13.11 35.95,4.7 34.05,12.4 36.25,13.1 35.25,17.9 34.85,21.3 33.05,16.6 23.75,11 19.2,6.5 4.95,18.7 3,27.8 3,30.3 3,32.9 23.9,9.45 16.05,7 31.4,10.1 22,5.8 28.84,7.1 22.2,12.7 18.5,18.7 27.4,18.4 26.25,2.87 25,48.4 27.1,50.7 12.3,40.1 12.3,35.7 10.3,22.8 35.9,24.4 36.6,26.1 33.5,26.7 34.1,28.4 36.6,34.2 10.6,35.7 10.6,40.1 6.1,45.6 36.6,51.2 36.6,57.9 36.6,64.2 18.35,11.35
  pour Top (rank 2): 0,65 37.5,65 37.5,4 29.3,4 28.7,3.4 28.7,2 8.8,2 8.8,3.4 8.2,4 0,4
  pour Bottom (rank 2): 0,65 37.5,65 37.5,4 29.3,4 28.7,3.4 28.7,2.2 8.8,2.2 8.8,3.4 8.2,4 0,4
N$1
  Top 0.11: R8.2 27.05,6.5 26.74,6.5 24.64,4.4 13,4.4 12.3,3.7 11.7,3.7 10.5,2.5 J2.71
  Top 0.15: J2.71
N$2
  Top 0.15: R14.2 R9.1 Q2.1
N$3
  Top 0.15: Q4.1 R11.1 R15.2
N$4
  Top 0.15: R1.2 15.1,62.2 15.2,62.3 15.3,62.3 15.48,62.48 D1.C
N$5
  Top 0.15: R13.1 35.1,22.7 34.35,21.95 U2.3
N$6
  Top 0.15: R2.2 15.1,58.7 15.2,58.8 15.3,58.8 15.48,58.98 D2.C
N$7
  Top 0.35: Q2.3 24.8,10.2 25.2,10.6 D8.A
N$8
  Top 0.2: R3.2 28.25,57.75 J1.B5
N$9
  Top 0.2: R4.2 31.25,58.25 J1.A5
N$10
  pour Top (no thermals): 34.2,15.2 34.2,14.6 36.47,14.6 36.47,16.7 36.1,16.7 36.1,16.1 35.2,15.2
N$11  (via drill 0.3)
  Top 0.15: R2.1 v13.3,58.3
  Bottom 0.15: v13.3,58.3 13.3,59.42 13.58,59.7 PWR_LED.2
N$12  (via drill 0.3)
  Top 0.15: R1.1 v13.3,61.8
  Bottom 0.15: v13.3,61.8 13.3,62.82 13.58,63.1 VIO_LED.2
N$13
  Top 0.15: R6.2 15.1,55.2 15.2,55.3 15.3,55.3 15.48,55.48 D3.C
N$14  (via drill 0.3)
  Top 0.15: R6.1 14.1,54.4 13.7,54 v13.3,54
  Bottom 0.15: v13.3,54 13.3,55.9 13.6,56.2 AUX_EN_LED.2
N$15
  Top 0.15: R14.1 22.75,6.55 22.4,6.9 Q1.3
N$16
  Top 0.15: R15.1 15.75,6.65 15.4,7 Q3.3
N$17
  Top 0.35: MEAS.4 R16.1
  Bottom 0.35: MEAS.2 MEAS.4
N$18  (via drill 0.3)
  Top 0.2: v22.7,63.9 23.4,63.9 23.9,63.4 C10.1 23.91,62.88 D10.VCC
  Bottom 0.2: RGB.1 23.78,63.9 v22.7,63.9
N$37  (via drill 0.3)
  Top 0.35: D6.C 10.8,10.57 MEAS.3 | D5.C v25.15,53.77 | v18.9,43.6 11.4,43.6 v9.6,41.8
  Bottom 0.3: MEAS.3 MEAS.1
  Bottom 0.35: v25.15,53.77 25.15,49.77 18.98,43.6 v18.9,43.6 | v9.6,41.8 9.6,20.6 11.5,18.7 11.5,16.8 9.7,15 MEAS.3
NOTECARD_RX  (via drill 0.3)
  Top 0.15: J6.62 v14,18.8 | v17.7,11.35 19.15,9.9 v22.5,9.9 | v24.5,2.83 J2.15
  Bottom 0.15: v14,18.8 14,15.05 v17.7,11.35 | v22.5,9.9 23.71,9.9 26.5,9.9 26.9,9.5 26.9,5.54 24.5,3.14 v24.5,2.83
NOTECARD_TX  (via drill 0.3)
  Top 0.15: J6.64 v13.5,18.2 | v18.77,10.86 19.13,10.5 v22.5,10.5 | v25.2,2.83 25,2.63 J2.13
  Bottom 0.15: v18.77,10.86 17.52,10.86 13.5,14.88 v13.5,18.2 | v22.5,10.5 26.4,10.5 27.4,9.5 27.4,5.4 25.2,3.2 v25.2,2.83
PWR_EN
  Top 0.15: R8.1 R7.2 27.1,8.95 20.4,8.95 Q1.1 20.2,9.15 13.4,9.15 Q3.1
SCL  (via drill 0.3)
  Top 0.15: J2.21 23,2.9 23.76,3.66 27.37,3.66 v27.9,4.19 | U1.6 34.63,12.44 v34.7,12.5 | J6.40 19.5,18.62 19.6,18.52 v19.6,16.8
  Bottom 0.15: v27.9,4.19 29.01,5.3 34.1,5.3 34.7,5.9 v34.7,12.5 34,13.2 26.4,13.2 23.2,16.4 20,16.4 v19.6,16.8
SDA  (via drill 0.3)
  Top 0.15: J2.19 23.5,3 23.9,3.4 27.7,3.4 v27.9,3.6 | v35.9,12.5 U1.5 | J6.42 19,18.62 19.17,18.45 v19.17,18
  Bottom 0.15: v27.9,3.6 29.3,5 34.3,5 35.9,6.6 v35.9,12.5 34.8,13.6 26.6,13.6 22.9,17.3 19.5,17.3 19.17,17.63 v19.17,18
SHLD  (via drill 0.3)
  other vias: 28.6,60.1 31.5,60.1
  pour Top: 25.7,59.8 34.3,59.8 34.3,65 25.7,65
  pour Bottom: 25.7,58.9 34.3,58.9 34.3,65 25.7,65
SIM_CLK
  Top 0.2: J5.S3 11.75,60.45 10.6,59.3 10.6,48.9 11.3,48.2 15.6,48.2 23.7,40.1 23.7,25.8 26,23.5 J6.14
SIM_IO
  Top 0.2: J5.S6 11.1,57.25 11.1,49.2 11.5,48.8 15.81,48.8 24.3,40.31 24.3,25.9 26.5,23.7 J6.12
SIM_RST  (via drill 0.3)
  Top 0.2: v12.1,50.4 15.01,50.4 24.91,40.51 24.91,26.09 27,24 J6.10 | J5.S2 3.25,59.25 v3.3,59.2
  Bottom 0.2: v3.3,59.2 11.1,59.2 12.1,58.2 v12.1,50.4
SIM_VCC  (via drill 0.3)
  Top 0.2: J6.8 v27.5,21.3 v27.5,21.8
  other vias: 14.5,46.1 15.1,46.1
  pour Top: 2.5,60.7 0.7,60.7 0.7,52.2 2.9,50 2.9,49.3 3.5,49.3 3.5,50.7 1.4,52.8 1.4,59.9 1.7,60.2 2.5,60.2
  pour Bottom: 27.7,21.1 27.8,21.2 27.8,33.8 15.1,46.5 14.5,46.5 14.3,46.3 14.3,46 27.2,33.1 27.2,21.2 27.3,21.1
  pour Top: 15.2,46.5 15.4,46.3 15.4,45.9 15.2,45.7 7.1,45.7 2.6,50.2 3.3,50.9 7.7,46.5
USB_IN_N  (via drill 0.3)
  Top 0.25: D4.3 29.5,57.33 29.4,57.43 29.4,57.91 29.75,58.26 J1.A7 v29.75,60.4 | v30.92,60.4 30.92,60.06 30.75,59.89 J1.B7
  Bottom 0.25: v30.92,60.4 v29.75,60.4
USB_IN_P
  Top 0.25: J1.B6 29.25,60.04 29.19,60.1 29.19,60.62 29.53,60.96 29.97,60.96 30.31,60.62 30.31,60.06 30.25,60 J1.A6 30.25,58.26 30.6,57.91 30.6,57.41 30.5,57.3 D4.1
USB_N  (via drill 0.3)
  Top 0.25: D4.4 29.5,55.9 29.35,55.75 29.35,55 v29.5,54.85 | v27.15,14.5 27.25,14.4 J6.9
  Bottom 0.25: v27.15,14.5 27.15,17.35 29.77,19.98 29.77,54.58 v29.5,54.85
USB_P  (via drill 0.3)
  Top 0.25: D4.6 30.5,55.9 30.65,55.75 30.65,55 v30.5,54.85 | v27.8,14.5 27.75,14.45 J6.7
  Bottom 0.25: v27.8,14.5 27.8,17.36 30.23,19.79 30.23,54.58 v30.5,54.85
V_USB  (via drill 0.3)
  Top 0.25: D4.5 v30,55.5 | J1.VBUS2 v27.55,58.4
  Top 0.3: J1.VBUS2 27.55,59.9 29.09,61.44 30.91,61.44 32.45,59.9 J1.VBUS1 | J6.13 v26.25,15.2
  Top 0.35: J1.VBUS1 v32.45,58.1 | D5.A v28.5,54.7
  Bottom 0.35: v26.25,15.2 26.25,18.05 28.5,20.3 v28.5,54.7 v28.5,54.71 29.29,55.5 v30,55.5 31,55.5 32.45,56.95 v32.45,58.1
VACT_GPS_IN  (via drill 0.3)
  Top 0.2: v23.9,21.6 23.9,21.2 24,21.1 J6.22
  Bottom 0.2: ANT_PWR.2 v23.89,21.61 v23.9,21.6
VACT_GPS_OUT  (via drill 0.3)
  Top 0.2: J6.20 v24.5,21.2
  Bottom 0.2: ANT_PWR.1 24.71,21.81 24.5,21.6 v24.5,21.2
VCC
  Top 0.35: Q4.3 16.7,10.2 16.33,10.57 D6.A
VCC_IN  (via drill 0.3)
  Top 0.3: v17.75,7.7 R11.2 | 17.85,8.1 v17.75,8.2
  Top 0.35: Q4.2 17.85,8.1
  Bottom 0.2: J2.74 9.75,3.25 | J2.72 10.25,3.65
  pour Bottom: 9.7,3 9.7,4.7 13.4,8.4 17.95,8.4 17.95,7.5 13.8,7.5 10.3,4 10.3,3
  pour Top (isolate 0.305): 17.85,8.35 17.65,8.35 17.55,8.25 17.55,7.5 17.65,7.4 17.85,7.4 17.95,7.5 17.95,8.25
VIN  (via drill 0.3)
  Top 0.2: 11.9,21.5 12,21.4 J6.70 | J6.72 11.5,21.1 11.9,21.5 | J6.74 11,21.1 11.4,21.5 11.9,21.5 | D2.A 13.72,60.52 14.1,60.9 v16.2,60.9
  Top 0.35: R13.2 C5.1 36.7,20.7 36.25,20.25 U2.1
  Top 0.4: v13.6,21.5 11.9,21.5 | v26.4,27.6 33.9,27.6 36.7,24.8 R13.2
  Top 0.5: R12.2 C6.1 11.4,22 11.9,21.5
  Bottom 0.2: v13.6,21.5 13.6,22.6 13,23.2 13,51.9 16.2,55.1 v16.2,60.9
  Bottom 0.4: v13.6,21.5 18.8,21.5 20.8,23.5 20.8,25.2 23.2,27.6 v26.4,27.6
  pour Top: 10.8,21 12.14,21 12.14,21.61 11.6,22.15 10.8,22.15
  pour Top (no thermals): 5.5,7.9 5.5,18.9 4.2,20.2 4.2,20.7 4.6,20.7 8.3,17 8.3,7.9
  pour Top: 8.3,4.8 8.3,9.1 5.5,9.1 5.5,7.9 5.5,6.6 7.4,4.7 8.3,4.7

### Text on the board
Bottom: v11
Measures: All units in mm.
tDocu: Board Thickness is 0.8mm | Beveled Edge | ENIG Finish | Alex Brudner